# Altium schematic sheet Connectors.SchDoc: Connectors
size OrCAD A; DocumentNumber: LM-003; Revision: 3.0; SheetNumber: 3; SheetTotal: 5
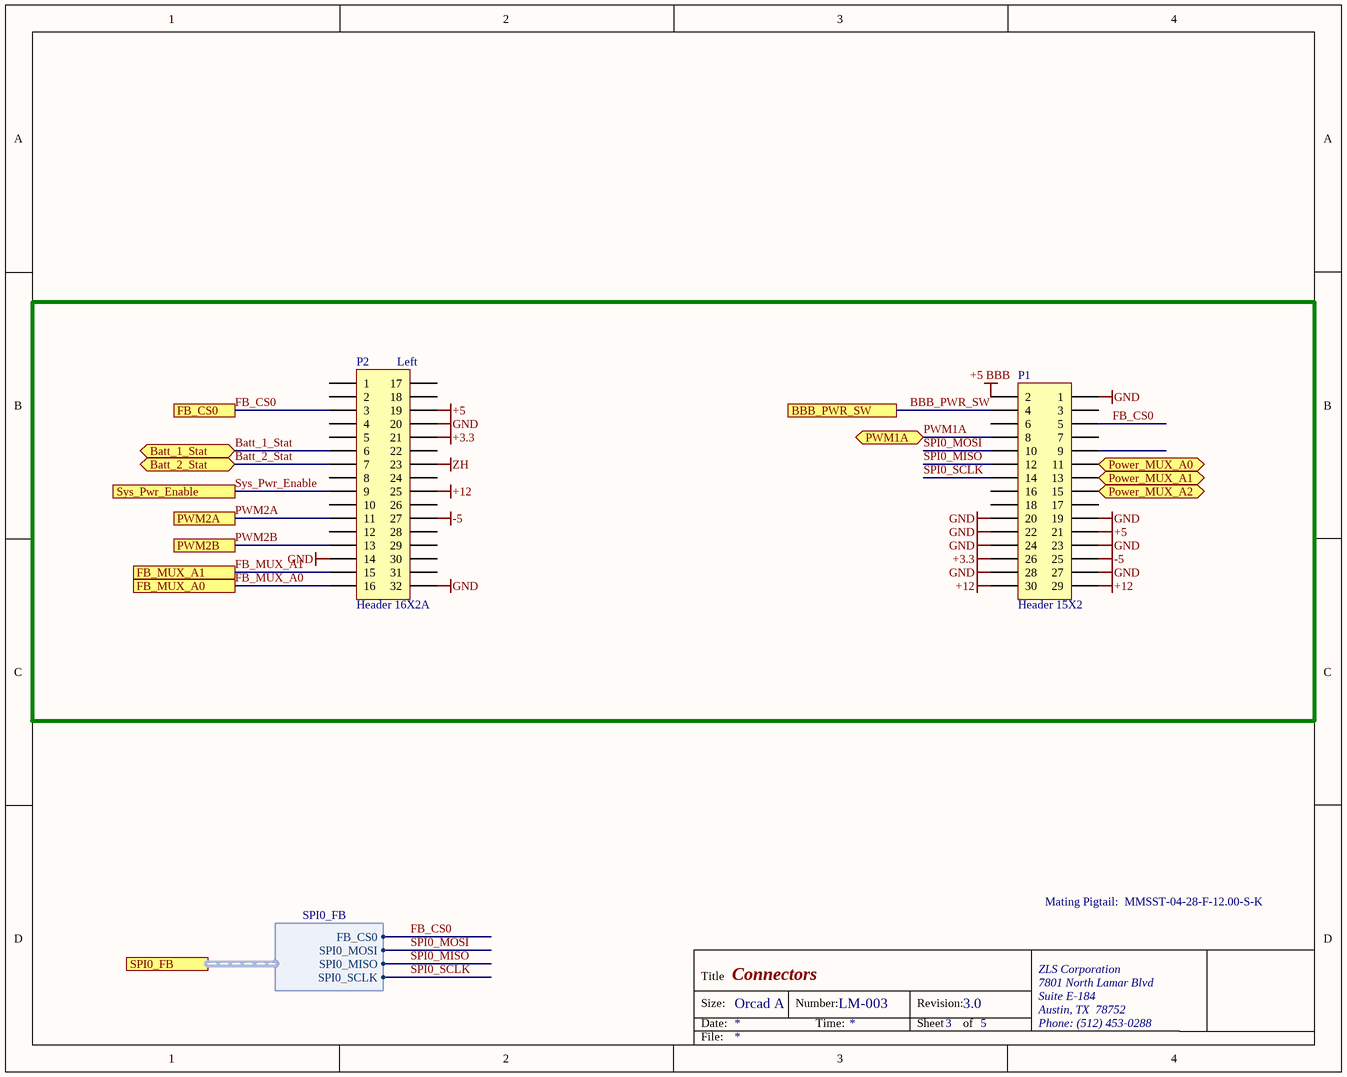
[diagram p0: Connectors.SchDoc]

## Parts
P1  Header 15X2  [HDR2X15]
P2  Header 16X2A  [HDR2X16_CEN]

## Blocks framed on the sheet
Left: P1 P2

## Ports
Batt_1_Stat, Batt_2_Stat, BBB_PWR_SW, FB_CS0, FB_MUX_A0, FB_MUX_A1, Power_MUX_A0, Power_MUX_A1, Power_MUX_A2, PWM1A, PWM2A, PWM2B, SPI0_FB (harness SPI0_FB), Sys_Pwr_Enable

## Harnesses
SPI0_FB: FB_CS0, SPI0_MOSI, SPI0_MISO, SPI0_SCLK

## Nets
+3.3: P1.26 P2.21
+5: P1.21 P2.19
+5 BBB: P1.2
+12: P1.29 P1.30 P2.25
-5: P1.25 P2.27
GND: P1.1 P1.19 P1.20 P1.22 P1.23 P1.24 P1.27 P1.28 P2.14 P2.20 P2.32
ZH: P2.23
Batt_1_Stat: P2.6 ; port Batt_1_Stat
Batt_2_Stat: P2.7 ; port Batt_2_Stat
BBB_PWR_SW: P1.4 ; port BBB_PWR_SW
FB_CS0: P1.5 P2.3 ; port FB_CS0, port SPI0_FB.FB_CS0
FB_MUX_A0: P2.16 ; port FB_MUX_A0
FB_MUX_A1: P2.15 ; port FB_MUX_A1
Power_MUX_A0: P1.11 ; port Power_MUX_A0
Power_MUX_A1: P1.13 ; port Power_MUX_A1
Power_MUX_A2: P1.15 ; port Power_MUX_A2
PWM1A: P1.8 ; port PWM1A
PWM2A: P2.11 ; port PWM2A
PWM2B: P2.13 ; port PWM2B
SPI0_MISO: P1.12 ; port SPI0_FB.SPI0_MISO
SPI0_MOSI: P1.10 ; port SPI0_FB.SPI0_MOSI
SPI0_SCLK: P1.14 ; port SPI0_FB.SPI0_SCLK
Sys_Pwr_Enable: P2.9 ; port Sys_Pwr_Enable

Not connected (* = marked no-connect by the designer): P1 3 6 7 9 16 17 18; P2 1 2 4 5 8 10 12 17 18 22 24 26 28 29 30 31

## Notes on the sheet
- Mating Pigtail:  MMSST-04-28-F-12.00-S-K
- Title
- Size:
- Date:
- Orcad A
- Number:
- Time:
- Revision:
- Sheet
- of
- ZLS Corporation
- 7801 North Lamar Blvd
- Suite E-184
- Austin, TX  78752
- Phone: (512) 453-0288
- File:

## Library data of the parts
P1 = Header 15X2: Header, 15-Pin, Dual row; LatestRevisionDate: 17-Jul-2002; LatestRevisionNote: Re-released for DXP Platform.; Publisher: Altium Limited
P2 = Header 16X2A: Header, 16-Pin, Dual row; LatestRevisionDate: 17-Jul-2002; LatestRevisionNote: Re-released for DXP Platform.; Publisher: Altium Limited